# EAGLE design nao_squr_geeezer (EAGLE 9.6.2)
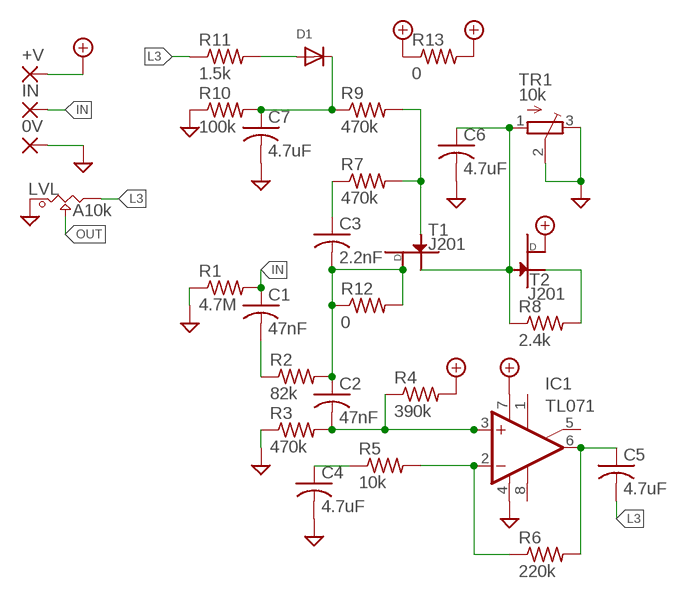
[diagram p0: schematic, sheet 1]

## Parts
0V  SMD2  [SMD1,27-2,54]
+V  SMD2  [SMD1,27-2,54]
C1  47nF  C-USC0603  [C0603]
C2  47nF  C-USC0603  [C0603]
C3  2.2nF  C-USC0603  [C0603]
C4  4.7uF  C-USC1206  [C1206]
C5  4.7uF  C-USC0805  [C0805]
C6  4.7uF  C-USC0805  [C0805]
C7  4.7uF  C-USC0805  [C0805]
D1  DIODESOD-123  [SOD-123]
IC1  TL071  TL071D  [SO08]
IN  SMD2  [SMD1,27-2,54]
LVL  A10k  POT_9MM_SMD  [POT_9MM_SMD]
R1  4.7M  R-US_R0603  [R0603]
R2  82k  R-US_R0603  [R0603]
R3  470k  R-US_R0603  [R0603]
R4  390k  R-US_R0603  [R0603]
R5  10k  R-US_R0603  [R0603]
R6  220k  R-US_R0603  [R0603]
R7  470k  R-US_R0603  [R0603]
R8  2.4k  R-US_R0603  [R0603]
R9  470k  R-US_R0603  [R0603]
R10  100k  R-US_R0603  [R0603]
R11  1.5k  R-US_R0603  [R0603]
R12  0  R-US_R0402  [R0402]
R13  0  R-US_R0603  [R0603]
T1  J201  MMBFJ201  [MMBFJ201]
T2  J201  MMBFJ201  [MMBFJ201]
TR1  10k  TRIMPOTTC33X  [TC33X]

## Nets
+9V: +V.1(P) IC1.7(V+) R4.2 R13.1 R13.2 T2.D
GND: 0V.1(P) C4.2 C6.2 C7.2 IC1.4(V-) LVL.1 R1.1 R3.1 R10.1 TR1.2(S) TR1.3(E)
IN: C1.1 IN.1(P) R1.2
L3: C5.2 LVL.3 R11.1
N$1: C1.2 R2.1
N$2: C2.1 C3.2 R2.2 R12.1 R12.2 T1.D
N$3: C2.2 IC1.3(+IN) R3.2 R4.1
N$4: IC1.2(-IN) R5.2 R6.1
N$5: C4.1 R5.1
N$6: C5.1 IC1.6(OUT) R6.2
N$7: C3.1 R7.1
N$8: R7.2 R9.2 T1.G
N$9: C6.1 R8.1 T1.S T2.G TR1.1(A)
N$10: R8.2 T2.S
N$11: C7.1 D1.C R9.1 R10.2
N$12: D1.A R11.2
OUT: LVL.2
Unconnected: IC1.1(ON1) IC1.5(ON2) IC1.8(OPT)

## Library data of the parts
0V +V IN = wirepad:SMD2: SMD PAD
C1-C7 = adafruit:C-US: CAPACITOR, American symbol
D1 = adafruit:DIODE: Diode SMADIODE - SMA Surface Mount Package 20V 1A Schottky Diode Digikey: 641-1014-6-ND DO-1N4148 - Through Hole Small Current Diode SOD-123 20V 1 A (.5mV Vf) Schottky Diode - Digikey: MBRX120TPMSCT-ND SOD-323 10V 570mA (.38mV Vf, 3ns) Schottky Diode - Digikey: ZLLS410CT-ND SOD-523 30V 30mA Schottky Diode (RB751S-40TE61) - Digikey: RB751S-40TE61CT-ND SOT23-R/W - SOT23 Package (R = Solder Paste/Reflow Ovens, W = Hand-Soldering) BAT54Film 40V 300mA - Digikey: 497-7162-1-ND
IC1 = linear:TL071: OP AMP
LVL = Mech_BO_CE_SW:POT_9MM_SMD
R1-R13 = adafruit:R-US_: RESISTOR, American symbol
T1 T2 = SOT23_201:MMBFJ201
TR1 = adafruit:TRIMPOT: SMT trimmer potentiometer part number TC33X http://www.ladyada.net/library/eagle

## Board
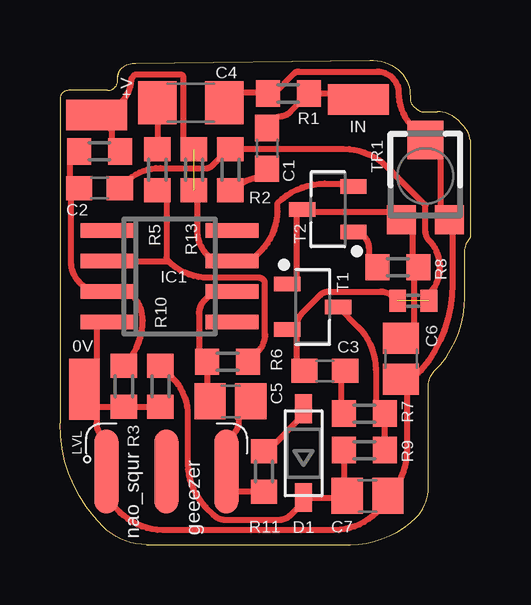
[diagram p1: board, top side]

Size 17.14 x 20.19 mm. Coordinates in mm from the lower left corner, seen from the top.
Outline: 12.1,0 3.62,0 arc-45 1.78,0.76 arc-45 0,5.05 0,18.57 arc-90 0.36,18.92 1.98,18.92 arc45 2.29,19.05 arc45 2.41,19.36 2.41,19.5
Outline: 12.1,0 12.12,0
Outline: 17.14,16.61 17.14,12.83 arc45 16.89,12.21 16.89,10.3 arc-45 15.62,7.24 arc45 15.37,6.63 15.37,2.37 arc-45 14.86,1.14 arc-45 12.1,0
Outline: 17.14,16.61 arc45 16.76,17.53
Outline: 2.54,19.81 arc45 2.41,19.5
Outline: 17.14,16.61 arc45 16.76,17.53
Outline: 16.76,17.53 16.61,17.68 arc45 15.75,18.03 15.17,18.03 arc-45 14.86,18.16 14.75,18.27 arc-45 14.61,18.54 14.61,18.69 arc45 14.22,19.68 arc45 12.92,20.19 3.15,20.07 arc45 2.54,19.81
Outline: 2.41,19.5 arc-45 2.54,19.81
Copper layers (1*16): Top 0.035mm / dielectric 1.5mm / Bottom 0.035mm
Design rules "default *": minimum track width 6mil, minimum drill 0.35mm, track to track 6mil, track to pad 6mil, pad to pad 6mil, via to via 6mil, smd to smd 6mil, copper to edge 10mil, drill to drill 6mil, minimum pad ring 10mil, minimum via ring 8mil, stop-mask expansion 4mil, vias tented up to drill 0mil, thermal gap 10mil

### Footprints (pad centres in the part's own frame; a part is rotated, then mirrored left to right if it is on the bottom)
SMD1,27-2,54 = smd 1.27 x 2.54: 1 0,0
C0603 = smd 1.1 x 1: 1 -0.85,0; 2 0.85,0
C1206 = smd 1.6 x 1.8: 1 -1.4,0; 2 1.4,0
C0805 = smd 1.3 x 1.5: 1 -0.85,0; 2 0.85,0
SOD-123 = smd 1.2 x 0.7: A 1.85,0; C -1.85,0
SO08 = smd 0.6 x 2.2: 1 -1.905,-2.6; 2 -0.635,-2.6; 3 0.635,-2.6; 4 1.905,-2.6; 5 1.905,2.6; 6 0.635,2.6; 7 -0.635,2.6; 8 -1.905,2.6
POT_9MM_SMD = smd 0.991 x 3.505: 1 -2.5,0; 2 0,0; 3 2.5,0
R0603 = smd 1 x 1.1: 1 -0.85,0; 2 0.85,0
R0402 = smd 0.7 x 0.9: 1 -0.65,0; 2 0.65,0
MMBFJ201 = smd 1.099 x 0.602: D -1.065,-0.95; G 1.065,0; S -1.065,0.95
TC33X = smd 1.2 x 1.2: 1 -1,-1.825; 3 1,-1.825 | smd 1.5 x 1.6: 2 0,1.5

### Placement (x,y rotation side)
0V  1.02,6.48 180 top
+V  1.52,17.91 90 top
C1  8.64,16.51 270 top
C2  1.65,14.86 180 top
C3  11.05,7.24 180 top
C4  5.46,18.41 0 top
C5  7.11,5.97 0 top
C6  14.22,7.75 270 top
C7  12.83,2.03 0 top
D1  10.16,3.81 90 top
IC1  4.57,11.18 270 top
IN  12.45,18.54 90 top
LVL  4.45,3.05 0 top
R1  9.53,18.8 0 top
R2  7.11,15.62 90 top
R3  2.67,6.6 90 top
R4  1.65,16.38 0 top
R5  4.06,15.62 270 top
R6  6.99,7.62 180 top
R7  12.7,5.46 0 top
R8  14.1,11.56 180 top
R9  12.7,3.94 0 top
R10  4.19,6.6 90 top
R11  8.51,3.05 90 top
R12  14.73,10.16 0 top
R13  5.59,15.62 90 top
T1  10.54,9.91 0 top
T2  11.18,13.97 180 top
TR1  15.24,15.37 0 top

### Tracks (layer width: path | path; a pad name or v marks a point on that pad's centre or on a via)
+9V  (1 unrouted)
  Top 0.254: T2.D arc45 11.94,15.05 11.05,15.05 arc45 9.07,14.23 9.07,13.88 arc-45 8.4,12.26 7.95,11.81 IC1.7 6.39,11.81 6.15,12.05 arc-45 5.71,13.11 5.71,14.64 R13.1 | R4.2 2.16,16.73 2.16,17.27 +V.1 2.03,17.91 2.58,18.45 arc45 2.98,19.43 3.15,19.59 5.01,19.59 arc-90 5.14,19.47 5.14,16.92 R13.2
GND
  Top 0.254: 0V.1 1.52,5.97 1.52,5.05 arc45 1.75,4.52 1.95,4.32 LVL.1 1.95,1.91 2.5,1.35 arc45 4.29,0.61 11.43,0.61 arc45 13.22,1.35 13.68,1.81 C7.2 13.73,2.09 arc45 14.48,3.88 14.48,6.64 C6.2 14.73,6.9 arc45 16.37,10.86 16.37,13.41 TR1.3 15.86,13.92 15.86,16.25 TR1.2 14.72,17.39 arc-45 14.12,18.83 arc90 13.24,19.71 9.95,19.71 arc45 9.77,19.64 8.93,18.8 R1.1 8.65,18.82 7.51,18.82 7.02,18.33 C4.2 | 0V.1 1.02,6.22 1.49,5.75 R3.1 R10.1 | IC1.4 1.59,9.27 1.52,9.2 1.52,6.99 0V.1
IN
  Top 0.254: C1.1 9.12,17.84 arc45 9.63,18.05 R1.2 12.19,18.8 IN.1
L3
  Top 0.254: C5.2 7.45,5.46 7.45,5.14 arc-45 7.23,4.6 6.95,4.32 LVL.3 6.86,2.96 6.86,2.2 R11.1
N$1
  Top 0.254: C1.2 8.64,15.53 8.38,15.28 arc45 7.3,14.83 7.24,14.77 R2.1
N$2  (1 unrouted)
  Top 0.254: C3.2 9.86,7.58 9.86,8.7 9.67,8.89 | 9.67,8.89 9.6,8.96 T1.D 9.48,9.02 | R12.1 13.92,10.32 arc45 13.38,10.54 11.18,10.54 arc45 10.87,10.41 10.11,9.66 arc45 9.89,9.12 9.67,8.89 | R12.2 15.38,10.42 arc45 15.85,11.56 arc45 15.38,12.69 arc-45 15.25,13.02 15.25,14.13 13.63,15.74 arc45 11.84,16.49 7.13,16.49 R2.2 7.03,16.47 6.33,15.77 arc-45 6.15,15.69 4.18,15.69 arc45 2.74,15.09 C2.1
N$3
  Top 0.254: R3.2 arc45 3.45,9.34 arc45 3,10.41 2.1,10.41 IC1.3 1.72,10.54 arc-90 0.47,11.79 0.47,14.43 0.8,14.76 C2.2 0.42,15.24 0.42,16 R4.1
N$4
  Top 0.254: R6.1 8.24,8.02 arc45 8.55,8.78 8.55,10.87 arc90 8.3,11.12 6.2,11.12 arc-45 4.51,11.82 | IC1.2 4.49,11.81 arc45 4.51,11.82 | 4.51,11.82 arc-45 4.45,11.97 4.45,14.39 R5.2
N$5
  Top 0.254: C4.1 R5.1
N$6
  Top 0.254: C5.1 6.26,6.22 6.13,6.35 R6.2 5.79,7.96 5.79,9.62 arc-45 6.02,10.16 6.39,10.54 IC1.6
N$7
  Top 0.254: C3.1 11.72,7.06 11.72,5.59 R7.1
N$8
  Top 0.254: T1.G 12.43,9.09 arc-45 13.17,7.29 13.17,5.84 R7.2 R9.2
N$9
  Top 0.254: C6.1 14.75,8.6 14.75,11.36 R8.1 14.69,11.81 14.69,13.09 TR1.1 13.94,13.84 10.24,13.84 T2.G 9.86,13.72 9.86,10.86 T1.S
N$10
  Top 0.254: R8.2 12.88,11.93 12.88,12.38 arc90 T2.S
N$11
  Top 0.254: 11.81,1.96 D1.C 10.16,1.77 9.63,1.24 arc-45 9.09,1.02 6.94,1.02 arc-45 6.4,1.24 6.08,1.56 arc-45 5.33,3.36 5.33,5.37 arc45 4.66,6.98 R10.2 | 11.81,1.96 11.9,1.96 C7.1 | R9.1 11.85,2 11.81,1.96
N$12
  Top 0.254: R11.2 8.65,3.9 10.16,5.41 D1.A

### Text on the board
tPlace: nao_squr | geeezer